# EAGLE design ServoCape_Rev2 (EAGLE 7.2.0)

## Sheet 1 of 4
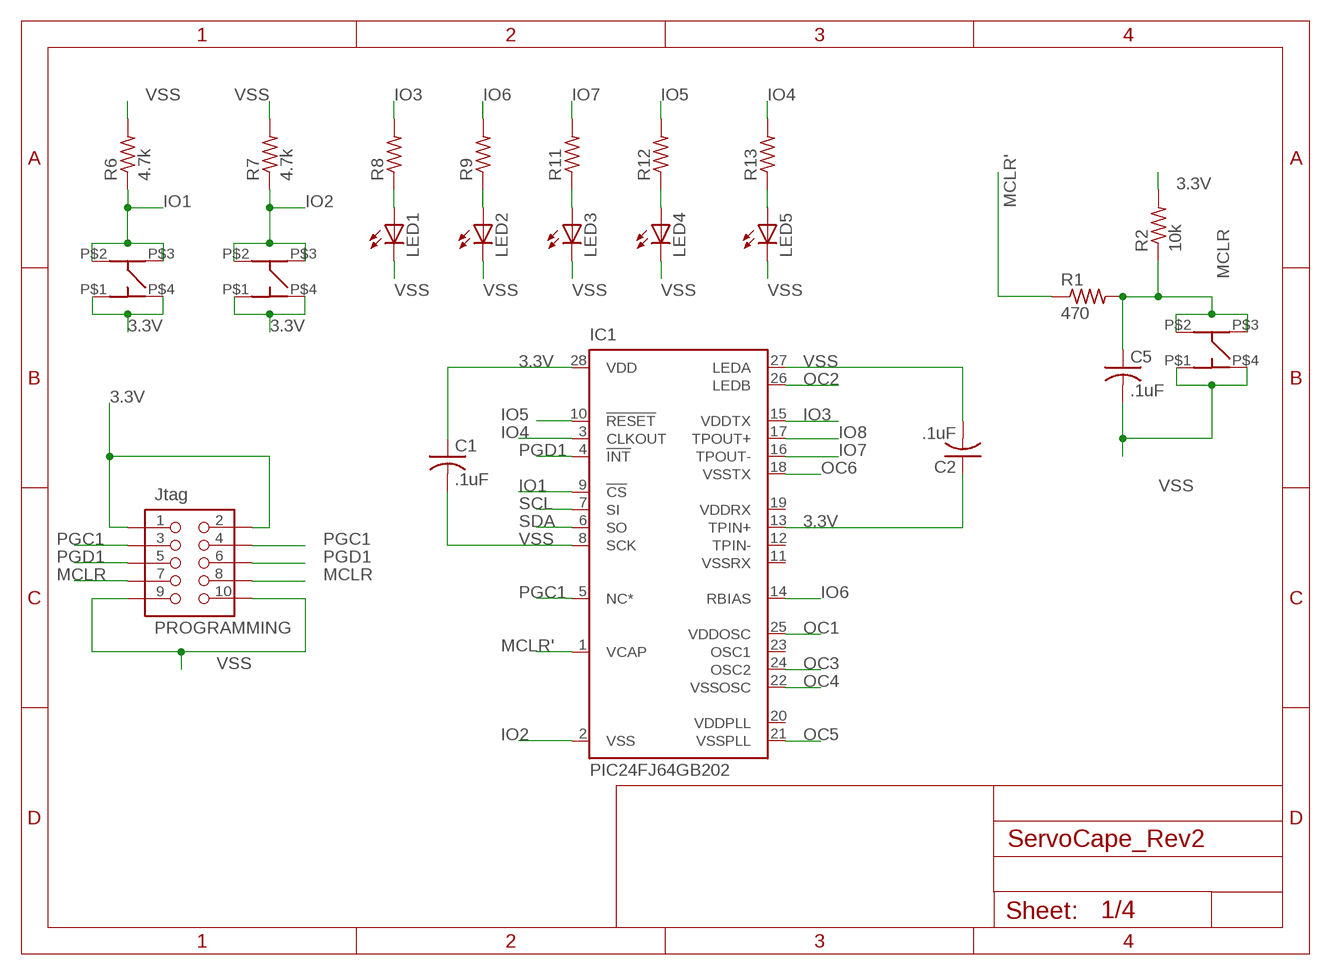
[diagram p0: schematic, sheet 1]

### Parts
C1  .1uF  C-USC0805  [C0805]
C2  .1uF  C-USC0805  [C0805]
C5  .1uF  C-USC0805  [C0805]
IC1  PIC24FJ64GB202  ENC28J60SP  [DIL28-3]
LED1  LED_LEDCHIPLED_1206  [LED_CHIPLED_1206]
LED2  LED_LEDCHIPLED_1206  [LED_CHIPLED_1206]
LED3  LED_LEDCHIPLED_1206  [LED_CHIPLED_1206]
LED4  LED_LEDCHIPLED_1206  [LED_CHIPLED_1206]
LED5  LED_LEDCHIPLED_1206  [LED_CHIPLED_1206]
PROGRAMMING  Jtag  MOTHER-BOARD-REV5_PIN-CONNECTOR74089  [MOTHER-BOARD-REV5_10-PIN-SMD]
R1  470  R-US_R0805  [R0805]
R2  10k  R-US_R0805  [R0805]
R6  4.7k  R-US_R0805  [R0805]
R7  4.7k  R-US_R0805  [R0805]
R8  R-US_M0805  [M0805]
R9  R-US_M0805  [M0805]
R11  R-US_M0805  [M0805]
R12  R-US_M0805  [M0805]
R13  R-US_M0805  [M0805]
U$1  Switch3  MC32882_SW  [MC32882_FINAL]
U$4  Switch1  MC32882_SW  [MC32882_FINAL]
U$5  Switch2  MC32882_SW  [MC32882_FINAL]

### Nets
3.3V: C1.1 C2.1 IC1.13(TPIN+) IC1.28(VDD) PROGRAMMING.1 PROGRAMMING.2 R2.2 U$4.P$1(P1) U$4.P$4(P4) U$5.P$1(P1) U$5.P$4(P4) ; also sheet 2,3
IO1: IC1.9(!CS) R6.1 U$4.P$2(P2) U$4.P$3(P3)
IO2: IC1.2(VSS) R7.1 U$5.P$2(P2) U$5.P$3(P3)
IO3: IC1.15(VDDTX) R8.2
IO4: IC1.3(CLKOUT) R13.2
IO5: IC1.10(!RESET) R12.2
IO6: IC1.14(RBIAS) R9.2
IO7: IC1.16(TPOUT-) R11.2
IO8: IC1.17(TPOUT+)
MCLR: C5.1 PROGRAMMING.7 PROGRAMMING.8 R1.2 R2.1 U$1.P$2(P2) U$1.P$3(P3)
MCLR': IC1.1(VCAP) R1.1
N$1: LED1.A R8.1
N$3: LED2.A R9.1
N$5: LED3.A R11.1
N$7: LED4.A R12.1
N$8: LED5.A R13.1
OC1: IC1.25(VDDOSC) ; also sheet 4
OC2: IC1.26(LEDB) ; also sheet 4
OC3: IC1.24(OSC2) ; also sheet 4
OC4: IC1.22(VSSOSC) ; also sheet 4
OC5: IC1.21(VSSPLL) ; also sheet 4
OC6: IC1.18(VSSTX) ; also sheet 4
PGC1: IC1.5(NC*) PROGRAMMING.3 PROGRAMMING.4
PGD1: IC1.4(!INT) PROGRAMMING.5 PROGRAMMING.6
SCL: IC1.7(SI) ; also sheet 3
SDA: IC1.6(SO) ; also sheet 3
VSS: C1.2 C2.2 C5.2 IC1.8(SCK) IC1.27(LEDA) LED1.C LED2.C LED3.C LED4.C LED5.C PROGRAMMING.9 PROGRAMMING.10 R6.2 R7.2 U$1.P$1(P1) U$1.P$4(P4) ; also sheet 2,3,4
Unconnected: IC1.11(VSSRX) IC1.12(TPIN-) IC1.19(VDDRX) IC1.20(VDDPLL) IC1.23(OSC1)

## Sheet 2 of 4: Power System
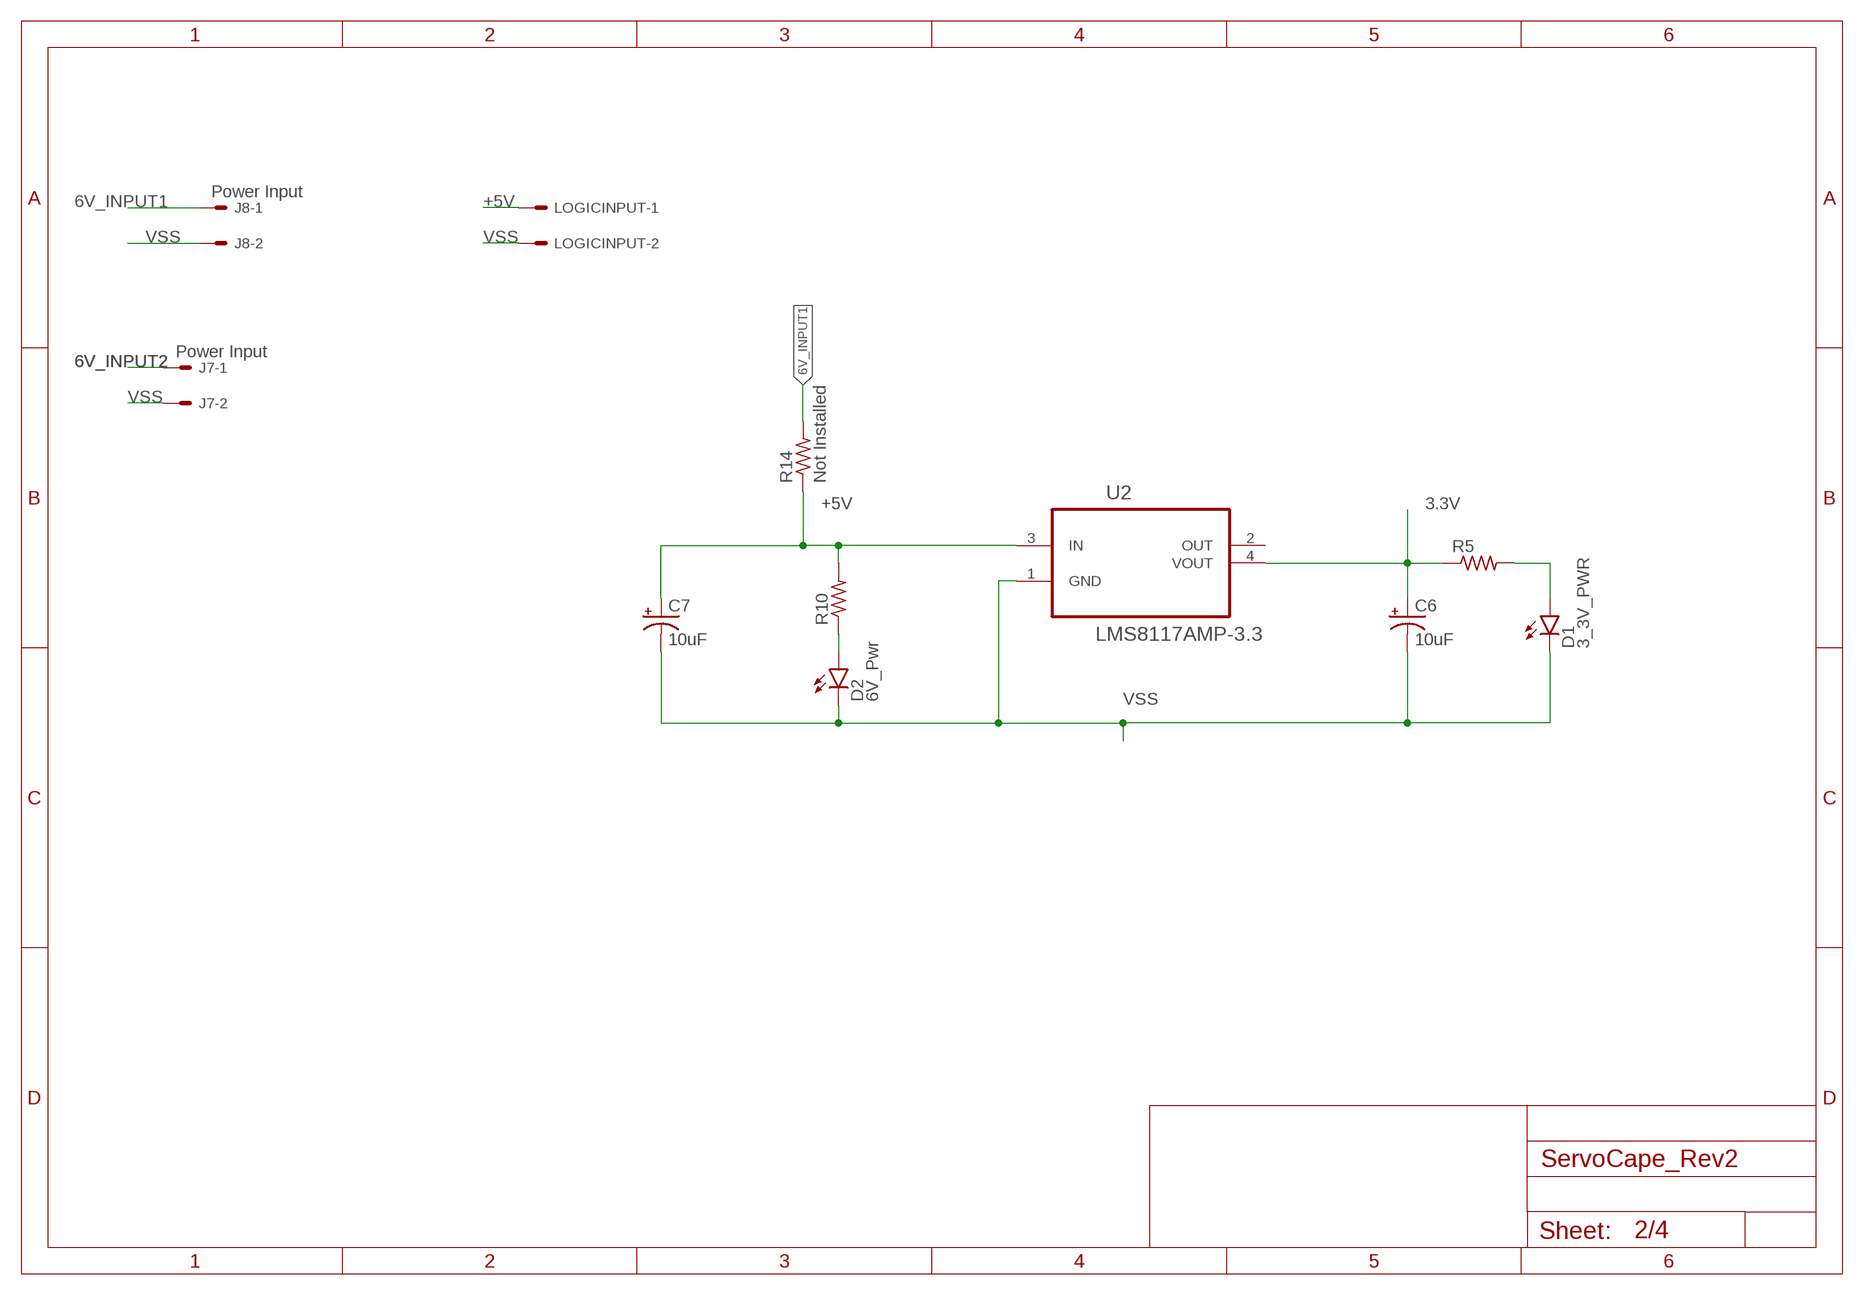
[diagram p1: schematic, sheet 2]

### Parts
C6  10uF  10UF-16V-10%(TANT)  [EIA3216]
C7  10uF  10UF-16V-10%(TANT)  [EIA3216]
D1  3_3V_PWR  LED-FKIT-1206  [FKIT-LED-1206]
D2  6V_Pwr  LED-FKIT-1206  [FKIT-LED-1206]
J7  Power Input  22-05-7028-02  [7395-02]
J8  Power Input  22-05-7028-02  [7395-02]
LOGICINPUT  22-05-7028-02  [7395-02]
R5  R-US_R0805W  [R0805W]
R10  R-US_R0805W  [R0805W]
R14  Not Installed  R-US_R0402  [R0402]
U2  LMS8117AMP-3.3  [SOT230P696X180-4N]

### Nets
3.3V: C6.A(+) R5.1 U2.4(VOUT) ; also sheet 1,3
6V_INPUT1: J8.1 R14.2 ; also sheet 4
6V_INPUT2: J7.1 ; also sheet 4
+5V: C7.A(+) LOGICINPUT.1 R10.2 R14.1 U2.3(IN)
N$6: D1.A R5.2
N$13: D2.A R10.1
VSS: C6.C(-) C7.C(-) D1.C D2.C J7.2 J8.2 LOGICINPUT.2 U2.1(GND) ; also sheet 1,3,4
Unconnected: U2.2(OUT)

## Sheet 3 of 4
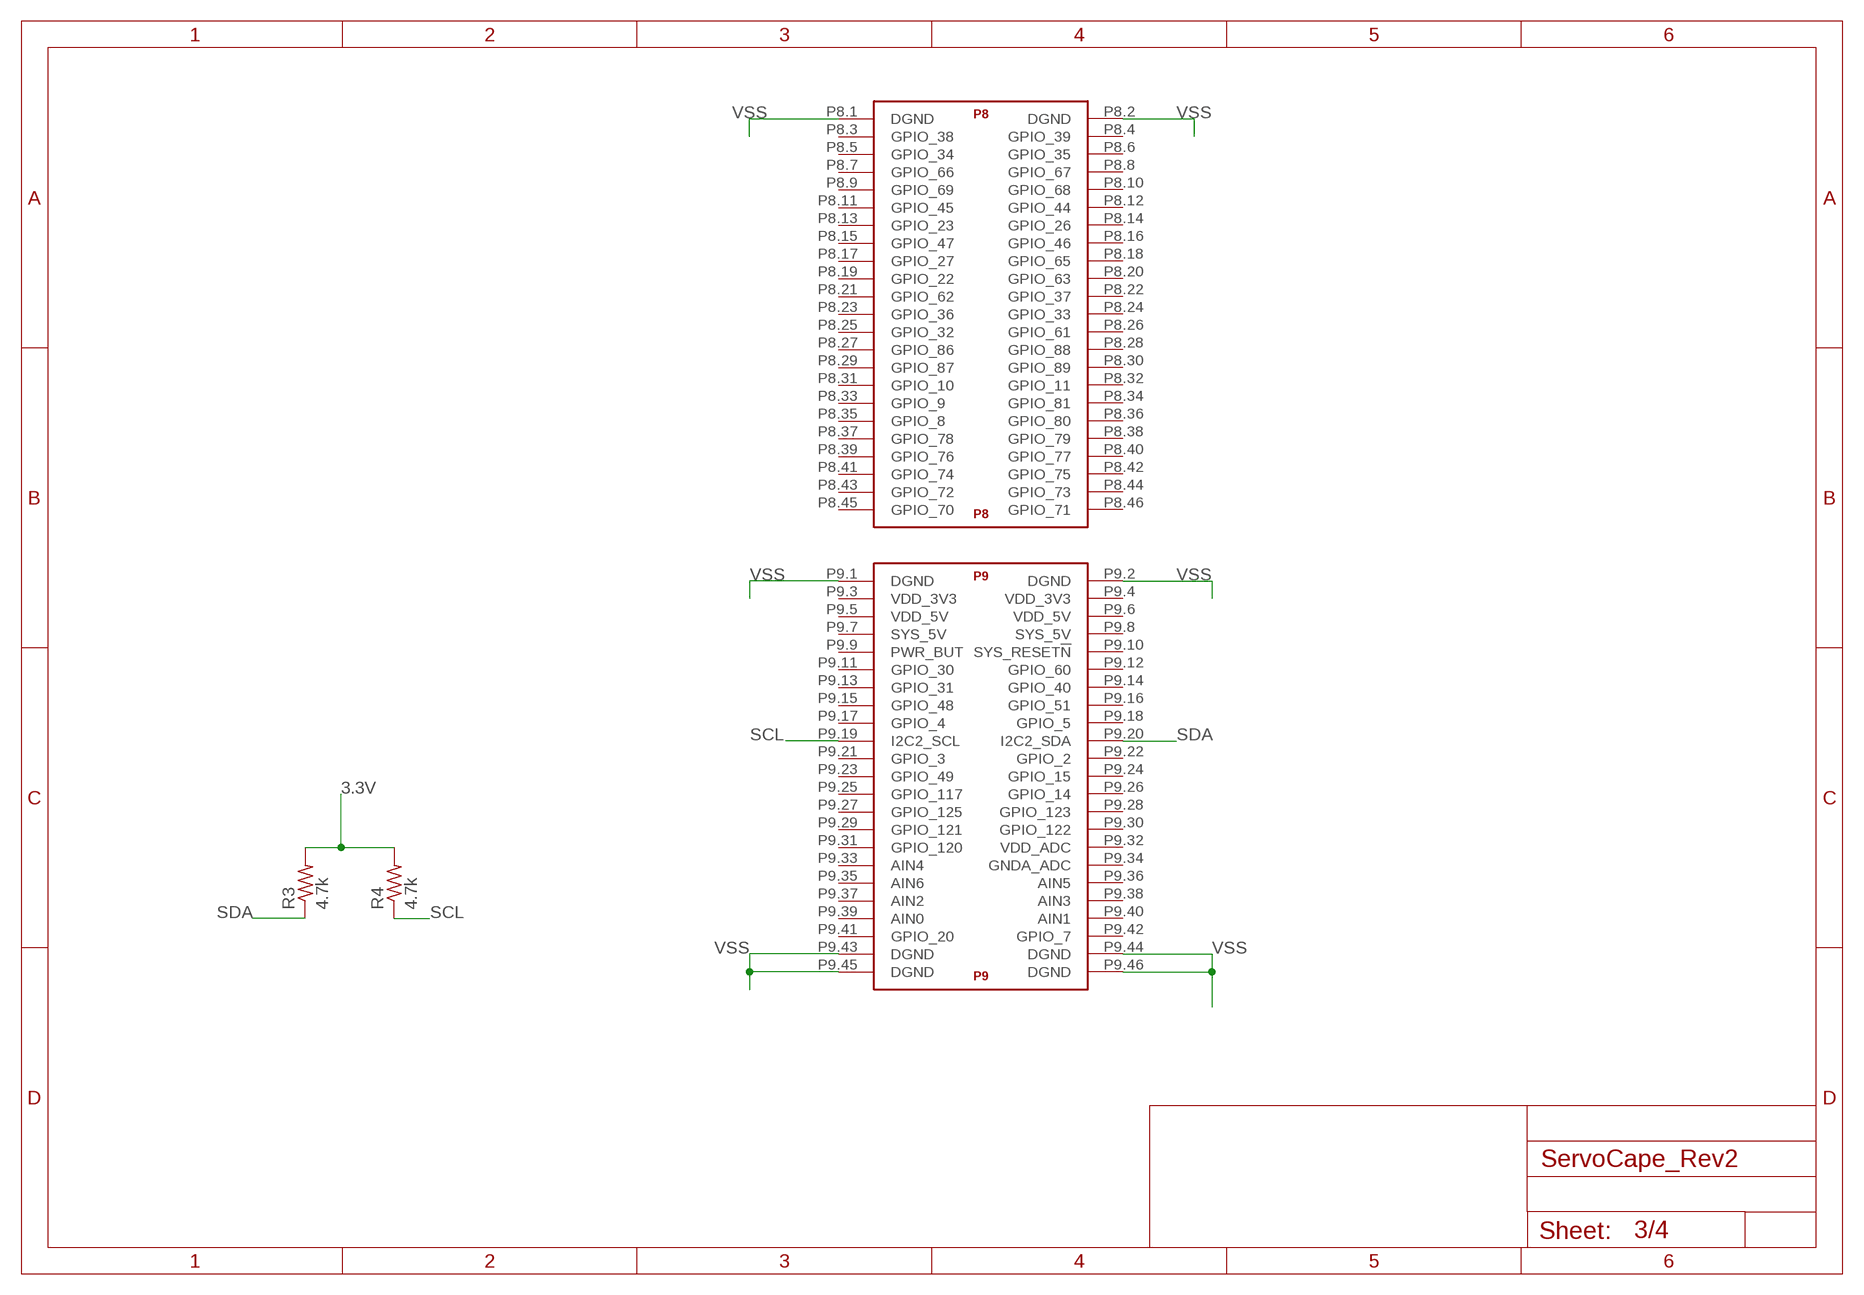
[diagram p2: schematic, sheet 3]

### Parts
R3  4.7k  R-US_R0805  [R0805]
R4  4.7k  R-US_R0805  [R0805]
U$2  BEAGLE_BONE_BLACK_CAPE  [BEAGLE_BONE_BLACK_CAPE]

### Nets
3.3V: R3.2 R4.2 ; also sheet 1,2
SCL: R4.1 U$2.P9.19(P9:I2C2_SCL) ; also sheet 1
SDA: R3.1 U$2.P9.20(P9:I2C2_SDA) ; also sheet 1
VSS: U$2.P8.1(P8:DGND) U$2.P8.2(P8:DGND) U$2.P9.1(P9:DGND) U$2.P9.2(P9:DGND) U$2.P9.43(P9:DGND) U$2.P9.44(P9:DGND) U$2.P9.45(P9:DGND) U$2.P9.46(P9:DGND) ; also sheet 1,2,4
Unconnected: U$2.P8.3(P8:GPIO_38) U$2.P8.4(P8:GPIO_39) U$2.P8.5(P8:GPIO_34) U$2.P8.6(P8:GPIO_35) U$2.P8.7(P8:GPIO_66) U$2.P8.8(P8:GPIO_67) U$2.P8.9(P8:GPIO_69) U$2.P8.10(P8:GPIO_68) U$2.P8.11(P8:GPIO_45) U$2.P8.12(P8:GPIO_44) U$2.P8.13(P8:GPIO_23) U$2.P8.14(P8:GPIO_26) U$2.P8.15(P8:GPIO_47) U$2.P8.16(P8:GPIO_46) U$2.P8.17(P8:GPIO_27) U$2.P8.18(P8:GPIO_65) U$2.P8.19(P8:GPIO_22) U$2.P8.20(P8:GPIO_63) U$2.P8.21(P8:GPIO_62) U$2.P8.22(P8:GPIO_37) U$2.P8.23(P8:GPIO_36) U$2.P8.24(P8:GPIO_33) U$2.P8.25(P8:GPIO_32) U$2.P8.26(P8:GPIO_61) U$2.P8.27(P8:GPIO_86) U$2.P8.28(P8:GPIO_88) U$2.P8.29(P8:GPIO_87) U$2.P8.30(P8:GPIO_89) U$2.P8.31(P8:GPIO_10) U$2.P8.32(P8:GPIO_11) U$2.P8.33(P8:GPIO_9) U$2.P8.34(P8:GPIO_81) U$2.P8.35(P8:GPIO_8) U$2.P8.36(P8:GPIO_80) U$2.P8.37(P8:GPIO_78) U$2.P8.38(P8:GPIO_79) U$2.P8.39(P8:GPIO_76) U$2.P8.40(P8:GPIO_77) U$2.P8.41(P8:GPIO_74) U$2.P8.42(P8:GPIO_75) U$2.P8.43(P8:GPIO_72) U$2.P8.44(P8:GPIO_73) U$2.P8.45(P8:GPIO_70) U$2.P8.46(P8:GPIO_71) U$2.P9.3(P9:VDD_3V3) U$2.P9.4(P9:VDD_3V3) U$2.P9.5(P9:VDD_5V) U$2.P9.6(P9:VDD_5V) U$2.P9.7(P9:SYS_5V) U$2.P9.8(P9:SYS_5V) U$2.P9.9(P9:PWR_BUT) U$2.P9.10(P9:SYS_RESET!N) U$2.P9.11(P9:GPIO_30) U$2.P9.12(P9:GPIO_60) U$2.P9.13(P9:GPIO_31) U$2.P9.14(P9:GPIO_40) U$2.P9.15(P9:GPIO_48) U$2.P9.16(P9:GPIO_51) U$2.P9.17(P9:GPIO_4) U$2.P9.18(P9:GPIO_5) U$2.P9.21(P9:GPIO_3) U$2.P9.22(P9:GPIO_2) U$2.P9.23(P9:GPIO_49) U$2.P9.24(P9:GPIO_15) U$2.P9.25(P9:GPIO_117) U$2.P9.26(P9:GPIO_14) U$2.P9.27(P9:GPIO_125) U$2.P9.28(P9:GPIO_123) U$2.P9.29(P9:GPIO_121) U$2.P9.30(P9:GPIO_122) U$2.P9.31(P9:GPIO_120) U$2.P9.32(P9:VDD_ADC) U$2.P9.33(P9:AIN4) U$2.P9.34(P9:GNDA_ADC) U$2.P9.35(P9:AIN6) U$2.P9.36(P9:AIN5) U$2.P9.37(P9:AIN2) U$2.P9.38(P9:AIN3) U$2.P9.39(P9:AIN0) U$2.P9.40(P9:AIN1) U$2.P9.41(P9:GPIO_20) U$2.P9.42(P9:GPIO_7)

## Sheet 4 of 4
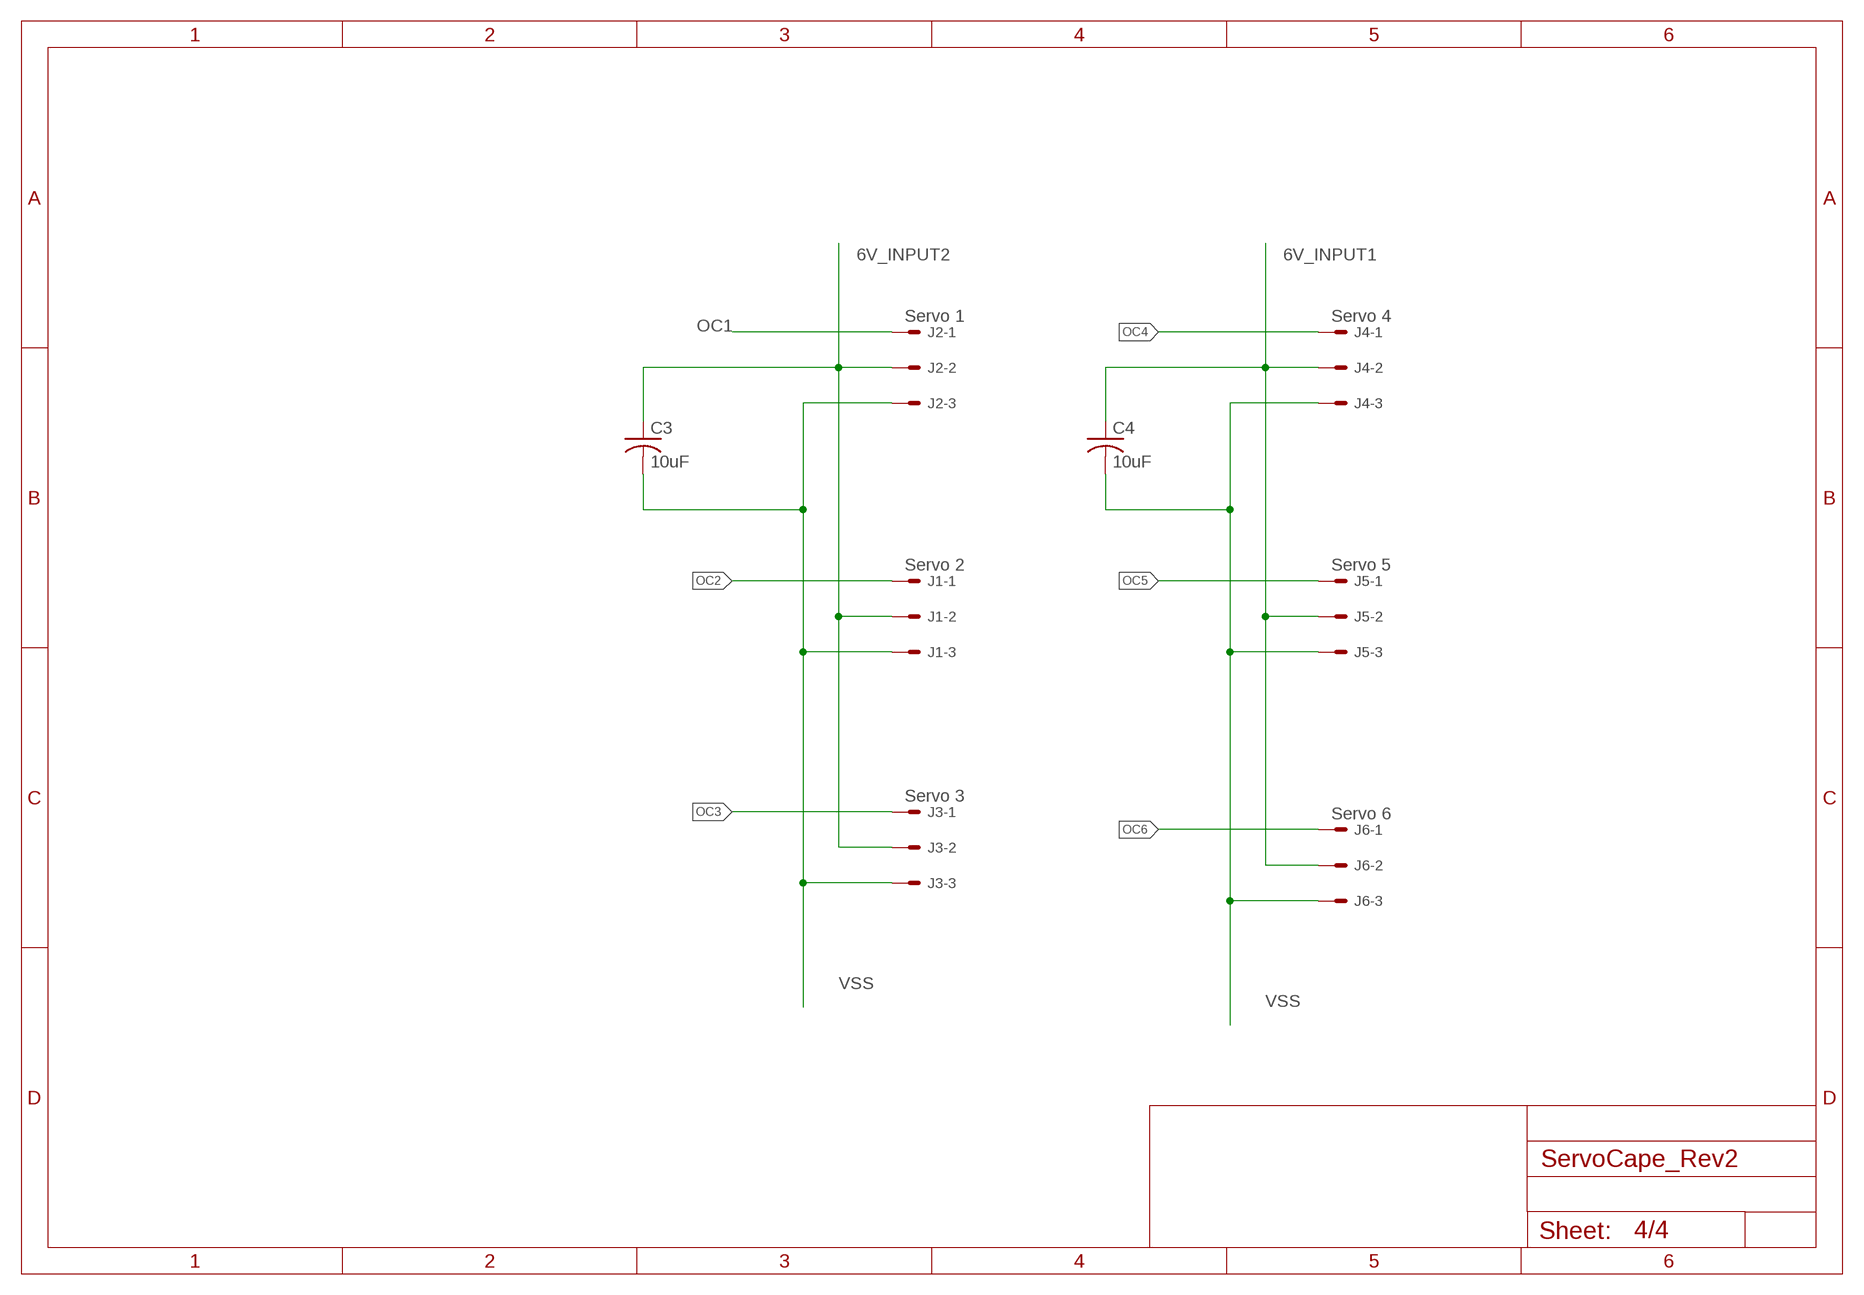
[diagram p3: schematic, sheet 4]

### Parts
C3  10uF  C-USC0805  [C0805]
C4  10uF  C-USC0805  [C0805]
J1  Servo 2  22-05-7038-03  [7395-03]
J2  Servo 1  22-05-7038-03  [7395-03]
J3  Servo 3  22-05-7038-03  [7395-03]
J4  Servo 4  22-05-7038-03  [7395-03]
J5  Servo 5  22-05-7038-03  [7395-03]
J6  Servo 6  22-05-7038-03  [7395-03]

### Nets
6V_INPUT1: C4.1 J4.2 J5.2 J6.2 ; also sheet 2
6V_INPUT2: C3.1 J1.2 J2.2 J3.2 ; also sheet 2
OC1: J2.1 ; also sheet 1
OC2: J1.1 ; also sheet 1
OC3: J3.1 ; also sheet 1
OC4: J4.1 ; also sheet 1
OC5: J5.1 ; also sheet 1
OC6: J6.1 ; also sheet 1
VSS: C3.2 C4.2 J1.3 J2.3 J3.3 J4.3 J5.3 J6.3 ; also sheet 1,2,3

## Library data of the parts
C1-C5 = rcl:C-US: CAPACITOR, American symbol
C6 C7 = SparkFun-Capacitors:10UF-16V-10%(TANT): CAP-00811 1206/EIA-3216 Tantalum capacitor; PROD_ID: CAP-00811
D1 D2 = SparkFun-LED:LED: LEDs Standard schematic elements and footprints for 5mm, 3mm, 1206, and 0603 sized LEDs. 5mm - Spark Fun Electronics SKU : COM-00529 (and others)
IC1 = microchip:ENC28J60: Stand-Alone Ethernet Controller with SPI Interface Source: http://ww1.microchip.com/downloads/en/DeviceDoc/39662c.pdf; MF: MICROCHIP; MPN: ENC28J60/SP; OC_FARNELL: 1084619; OC_NEWARK: 96K3661
J1-J6 = con-molex:22-?-03: CONNECTOR wire to board 2.54 mm (.1 inch) pitch header; OC_FARNELL: unknown; OC_NEWARK: unknown
J7 J8 LOGICINPUT = con-molex:22-?-02: CONNECTOR wire to board 2.54 mm (.1 inch) pitch header; OC_FARNELL: 9731601; OC_NEWARK: unknown
LED1-LED5 = motherboard_i_autoroute:LED_LED: LED OSRAM: - CHIPLED LG R971, LG N971, LY N971, LG Q971, LY Q971, LO R971, LY R971 LH N974, LH R974 LS Q976, LO Q976, LY Q976 LO Q996 - Hyper CHIPLED LW Q18S LB Q993, LB Q99A, LB R99A - SideLED LS A670, LO A670, LY A670, LG A670, LP A670 LB A673, LV A673, LT A673, LW A673 LH A674 LY A675 LS A676, LA A676, LO A676, LY A676, LW A676 LS A679, LY A679, LG A679 - Hyper Micro SIDELED® LS Y876, LA Y876, LO Y876, LY Y876 LT Y87S - SmartLED LW L88C, LW L88S LB L89C, LB L89S, LG L890 LS L89K, LO L89K, LY L89K LS L896, LA L896, LO L896, LY L896 - TOPLED LS T670, LO T670, LY T670, LG T670, LP T670 LSG T670, LSP T670, LSY T670, LOP T670, LYG T670 LG T671, LOG T671, LSG T671 LB T673, LV T673, LT T673, LW T673 LH T674 LS T676, LA T676, LO T676, LY T676, LB T676, LH T676, LSB T676, LW T676 LB T67C, LV T67C, LT T67C, LS T67K, LO T67K, LY T67K, LW E67C LS E67B, LA E67B, LO E67B, LY E67B, LB E67C, LV E67C, LT E67C LW T67C LS T679, LY T679, LG T679 LS T770, LO T770, LY T770, LG T770, LP T770 LB T773, LV T773, LT T773, LW T773 LH T774 LS E675, LA E675, LY E675, LS T675 LS T776, LA T776, LO T776, LY T776, LB T776 LHGB T686 LT T68C, LB T68C - Hyper Mini TOPLED® LB M676 - Mini TOPLED Santana® LG M470 LS M47K, LO M47K, LY M47K Source: http://www.osram.convergy.de LUXEON: - LUMILED® LXK2-PW12-R00, LXK2-PW12-S00, LXK2-PW14-U00, LXK2-PW14-V00 LXK2-PM12-R00, LXK2-PM12-S00, LXK2-PM14-U00 LXK2-PE12-Q00, LXK2-PE12-R00, LXK2-PE12-S00, LXK2-PE14-T00, LXK2-PE14-U00 LXK2-PB12-K00, LXK2-PB12-L00, LXK2-PB12-M00, LXK2-PB14-N00, LXK2-PB14-P00, LXK2-PB14-Q00 LXK2-PR12-L00, LXK2-PR12-M00, LXK2-PR14-Q00, LXK2-PR14-R00 LXK2-PD12-Q00, LXK2-PD12-R00, LXK2-PD12-S00 LXK2-PH12-R00, LXK2-PH12-S00 LXK2-PL12-P00, LXK2-PL12-Q00, LXK2-PL12-R00 Source: www.luxeon.com KINGBRIGHT: KA-3528ASYC Source: www.kingbright.com
PROGRAMMING = Mother-Board-rev5:MOTHER-BOARD-REV5_PIN-CONNECTOR
R1-R14 = rcl:R-US_: RESISTOR, American symbol
U2 = NSC-LMS8117AMP:LMS8117AMP-3.3: Low-Dropout Linear Regulator; MPN: LMS8117AMP-3.3; OC_FARNELL: 1469032; OC_NEWARK: 41K3020; PACKAGE: SOT-223-3; SUPPLIER: National Semiconductor
U$1 U$4 U$5 = Parts4Class:MC32882_SW
U$2 = SparkFun-Boards:BEAGLE_BONE_BLACK_CAPE

## Net classes
0 default: width 0.203 mm, drill 0.508 mm, clearance 0.254 mm

## Board
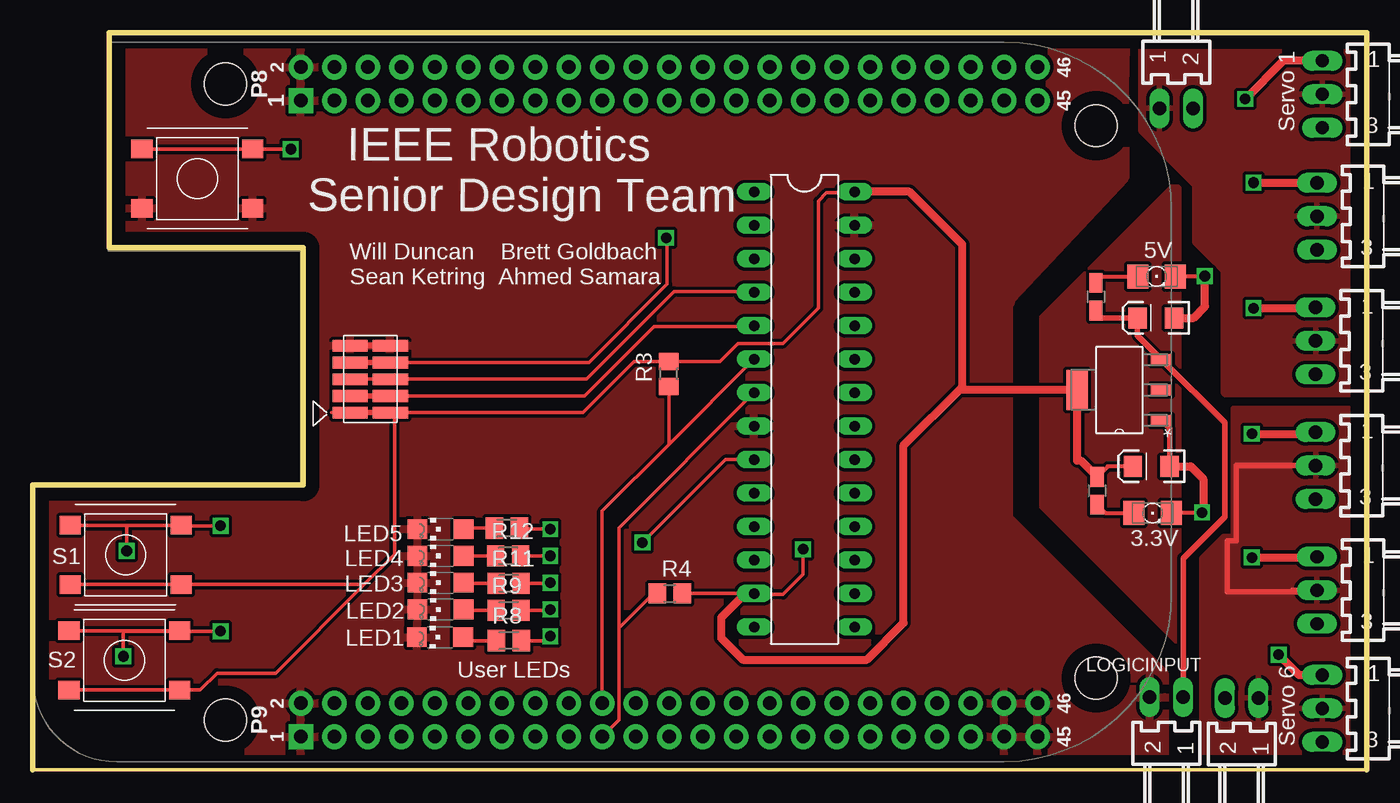
[diagram p4: board, top side]
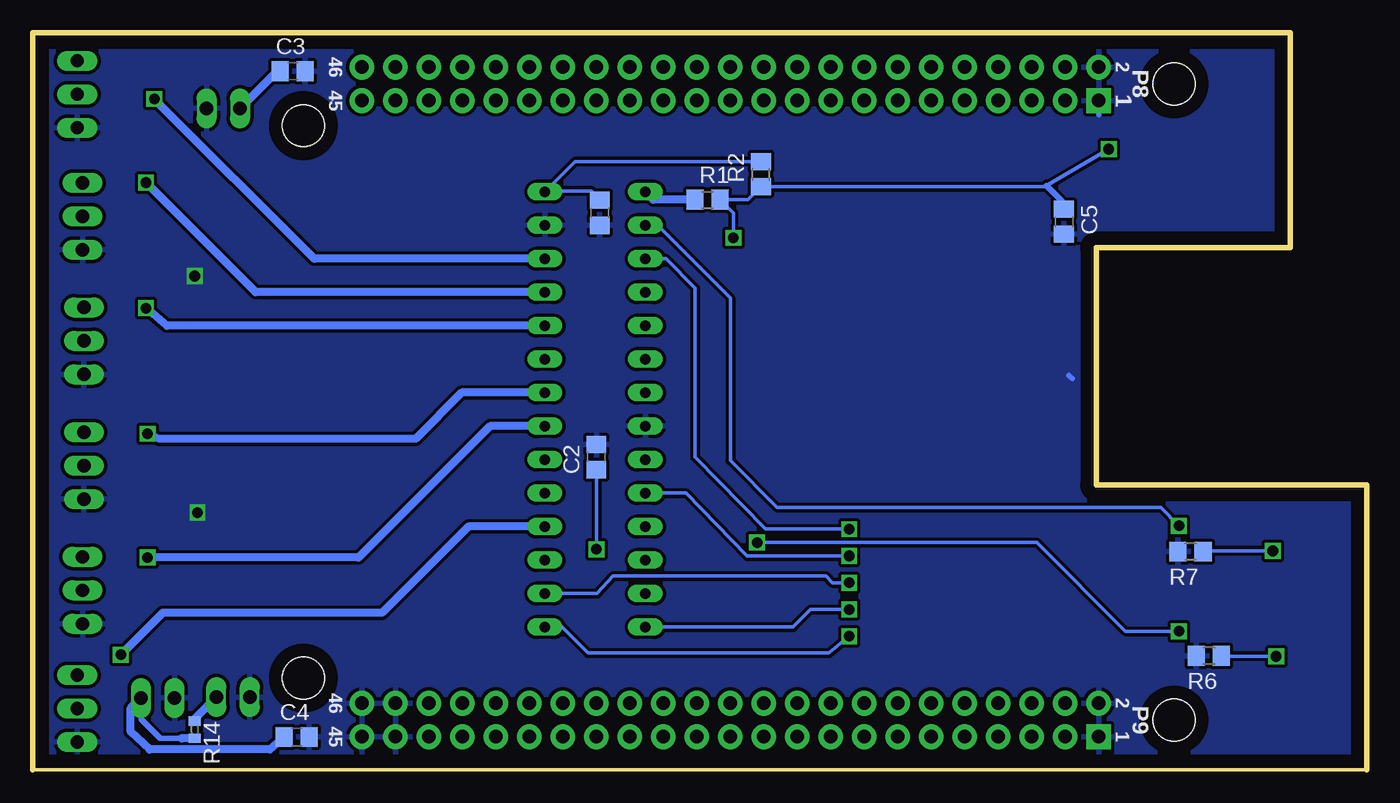
[diagram p5: board, bottom side, seen from below]

Size 101.15 x 55.9 mm. Coordinates in mm from the lower left corner, seen from the top.
Outline: 5.8,55.9 5.8,39.6 20.5,39.6 20.5,21.6 0,21.6 0,0 101.15,0 101.15,55.9 5.8,55.9
Copper layers (1*16): Top 0.035mm / dielectric 1.5mm / Bottom 0.035mm
Design rules "default *": minimum track width 10mil, minimum drill 24mil, track to track 8mil, track to pad 8mil, pad to pad 8mil, via to via 8mil, smd to smd 8mil, copper to edge 40mil, drill to drill 8mil, minimum pad ring 10mil, minimum via ring 8mil, stop-mask expansion 4mil, vias tented up to drill 0mil, thermal gap 10mil

### Footprints (pad centres in the part's own frame; a part is rotated, then mirrored left to right if it is on the bottom)
C0805 = smd 1.3 x 1.5: 1 -0.95,0; 2 0.95,0
EIA3216 = smd 1.4 x 1.6: A 1.4,0; C -1.4,0
FKIT-LED-1206 = smd 1.6 x 1.803: A -1.422,0; C 1.422,0
DIL28-3 = drill 0.813 long: 1 -16.51,-3.81; 2 -13.97,-3.81; 3 -11.43,-3.81; 4 -8.89,-3.81; 5 -6.35,-3.81; 6 -3.81,-3.81; 7 -1.27,-3.81; 8 1.27,-3.81; 9 3.81,-3.81; 10 6.35,-3.81; 11 8.89,-3.81; 12 11.43,-3.81; 13 13.97,-3.81; 14 16.51,-3.81; 15 16.51,3.81; 16 13.97,3.81; 17 11.43,3.81; 18 8.89,3.81; 19 6.35,3.81; 20 3.81,3.81; 21 1.27,3.81; 22 -1.27,3.81; 23 -3.81,3.81; 24 -6.35,3.81; 25 -8.89,3.81; 26 -11.43,3.81; 27 -13.97,3.81; 28 -16.51,3.81
7395-03 = drill 1.016 long: 1 2.54,0; 2 0,0; 3 -2.54,0
7395-02 = drill 1.016 long: 1 1.27,0; 2 -1.27,0
LED_CHIPLED_1206 = smd 1.5 x 1.5: A 0,-1.75; C 0,1.75
MOTHER-BOARD-REV5_10-PIN-SMD = smd 0.889 x 2.667: 1 -2.54,1.524; 2 -2.54,-1.524; 3 -1.27,1.524; 4 -1.27,-1.524; 5 0,1.524; 6 0,-1.524; 7 1.27,1.524; 8 1.27,-1.524; 9 2.54,1.524; 10 2.54,-1.524
R0805 = smd 1.3 x 1.5: 1 -0.95,0; 2 0.95,0
R0805W = smd 1.5 x 1: 1 -1.052,0; 2 1.052,0
M0805 = smd 1.3 x 1.6: 1 -0.95,0; 2 0.95,0
R0402 = smd 0.7 x 0.9: 1 -0.65,0; 2 0.65,0
SOT230P696X180-4N = smd 1.6 x 0.838: 1 -3.2,2.311; 2 -3.2,0; 3 -3.2,-2.311 | smd 1.6 x 3.023: 4 3.2,0
MC32882_FINAL = smd 1.6 x 1.4: P$1 -4.2,-2.25; P$2 -4.2,2.25; P$3 4.2,2.25; P$4 4.2,-2.25
BEAGLE_BONE_BLACK_CAPE = drill 1.016 pad 1.88 square: P8.1 20.32,50.165; P9.1 20.32,1.905 | drill 1.016 pad 1.88: P8.2 20.32,52.705; P8.3 22.86,50.165; P8.4 22.86,52.705; P8.5 25.4,50.165; P8.6 25.4,52.705; P8.7 27.94,50.165; P8.8 27.94,52.705; P8.9 30.48,50.165; P8.10 30.48,52.705; P8.11 33.02,50.165; P8.12 33.02,52.705; P8.13 35.56,50.165; P8.14 35.56,52.705; P8.15 38.1,50.165; P8.16 38.1,52.705; P8.17 40.64,50.165; P8.18 40.64,52.705; P8.19 43.18,50.165; P8.20 43.18,52.705; P8.21 45.72,50.165; P8.22 45.72,52.705; P8.23 48.26,50.165; P8.24 48.26,52.705; P8.25 50.8,50.165; P8.26 50.8,52.705; P8.27 53.34,50.165; P8.28 53.34,52.705; P8.29 55.88,50.165; P8.30 55.88,52.705; P8.31 58.42,50.165; P8.32 58.42,52.705; P8.33 60.96,50.165; P8.34 60.96,52.705; P8.35 63.5,50.165; P8.36 63.5,52.705; P8.37 66.04,50.165; P8.38 66.04,52.705; P8.39 68.58,50.165; P8.40 68.58,52.705; P8.41 71.12,50.165; P8.42 71.12,52.705; P8.43 73.66,50.165; P8.44 73.66,52.705; P8.45 76.2,50.165; P8.46 76.2,52.705; P9.2 20.32,4.445; P9.3 22.86,1.905; P9.4 22.86,4.445; P9.5 25.4,1.905; P9.6 25.4,4.445; P9.7 27.94,1.905; P9.8 27.94,4.445; P9.9 30.48,1.905; P9.10 30.48,4.445; P9.11 33.02,1.905; P9.12 33.02,4.445; P9.13 35.56,1.905; P9.14 35.56,4.445; P9.15 38.1,1.905; P9.16 38.1,4.445; P9.17 40.64,1.905; P9.18 40.64,4.445; P9.19 43.18,1.905; P9.20 43.18,4.445; P9.21 45.72,1.905; P9.22 45.72,4.445; P9.23 48.26,1.905; P9.24 48.26,4.445; P9.25 50.8,1.905; P9.26 50.8,4.445; P9.27 53.34,1.905; P9.28 53.34,4.445; P9.29 55.88,1.905; P9.30 55.88,4.445; P9.31 58.42,1.905; P9.32 58.42,4.445; P9.33 60.96,1.905; P9.34 60.96,4.445; P9.35 63.5,1.905; P9.36 63.5,4.445; P9.37 66.04,1.905; P9.38 66.04,4.445; P9.39 68.58,1.905; P9.40 68.58,4.445; P9.41 71.12,1.905; P9.42 71.12,4.445; P9.43 73.66,1.905; P9.44 73.66,4.445; P9.45 76.2,1.905; P9.46 76.2,4.445 | hole 3.175: 14.605,3.175; 80.645,6.35; 80.645,48.26; 14.605,51.435

### Placement (x,y rotation side)
C1  58.17,42.26 270 bottom
C2  58.42,23.71 90 bottom
C3  81.46,53 0 bottom
C4  81.15,2.48 0 bottom
C5  22.95,41.58 270 bottom
C6  84.83,23.02 180 top
C7  85.17,34.28 180 top
D1  84.93,19.47 0 top
D2  85.24,37.42 0 top
IC1  58.51,27.34 270 top
J1  97.79,51.25 90 top
J2  97.39,41.99 90 top
J3  97.29,32.53 90 top
J4  97.29,23.07 90 top
J5  97.39,13.61 90 top
J6  97.79,4.65 90 top
J7  86.72,50.18 180 top
J8  91.69,5.45 0 top
LED1  30.87,10.06 90 top
LED2  30.91,12.16 90 top
LED3  30.91,14.19 90 top
LED4  30.91,16.22 90 top
LED5  30.91,18.25 90 top
LOGICINPUT  85.98,5.5 0 top
PROGRAMMING  25.58,29.63 90 top
R1  49.98,43.24 0 bottom
R2  45.94,45.18 90 bottom
R3  48.23,30.03 90 top
R4  48.3,13.37 0 top
R5  80.72,21.16 270 top
R6  11.95,8.65 180 bottom
R7  13.35,16.55 180 bottom
R8  36.09,9.79 0 top
R9  36.07,12.08 0 top
R10  80.61,35.88 270 top
R11  36.07,14.14 0 top
R12  36.04,16.22 0 top
R13  35.94,18.33 0 top
R14  88.87,3.04 270 bottom
U2  82.4,28.81 180 top
U$1  12.47,44.85 0 top
U$2  0,0.6 0 top
U$4  6.93,8.3 0 top
U$5  7.03,16.3 0 top

### Tracks (layer width: path | path; a pad name or v marks a point on that pad's centre or on a via)
3.3V  (via drill 0.8)
  Top 0.254: R4.2 IC1.13 54.77,13.3 56.9,13.3 58.42,14.82 v58.42,16.73 | IC1.28 62.26,43.78 60.2,43.78 59.56,43.15 59.56,35.02 56.9,32.35 53.47,32.35 52.1,30.98 R3.2 48.21,30.95 45.59,30.95 41.73,27.09 PROGRAMMING.2 27.43,26.77 27.43,16.35 25.14,14.05 | U$4.P$1 U$4.P$4 12.69,6.05 13.97,7.33 18.41,7.33 25.14,14.05 | 25.14,14.05 U$5.P$4 U$5.P$1 | PROGRAMMING.1 22.66,27.09
  Top 0.305: C6.A 81.52,23.02 R5.1
  Top 0.406: PROGRAMMING.1 PROGRAMMING.2
  Top 0.61: R5.1 79.48,23.46 79.2,23.46 U2.4 70.57,28.81 70.41,28.97 | 70.41,28.97 70.48,29.05 70.48,39.84 66.48,43.85 IC1.28 | IC1.13 54.04,13.37 52.2,11.52 52.2,10 53.85,8.35 63.25,8.35 66.04,11.14 66.04,24.6 70.41,28.97
  Bottom 0.254: C2.1 v58.42,16.73 | C1.1 58.17,43.27 58.8,43.91 62.27,43.91 IC1.28 60.05,46.13 R2.2
6V_INPUT1
  Top 0.406: 95.53,13.48 95.53,13.61 J5.2 97.39,13.48 90.58,13.48 90.58,17.36 91.26,17.36 91.26,23.07 J4.2 95,23.07 95,23.08
  Bottom 0.406: J8.1 92.96,3.82 91.52,2.38 89.86,2.38
  Bottom 0.61: C4.1 83.19,1.54 92.3,1.54 93.73,2.86 93.73,4.68 J8.1 | R14.2 89.84,2.39 89.86,2.38
  pour Top: 88.75,1.13 99.82,1.13 99.82,17.69 90.32,17.69 88.65,16.02 88.65,1.23
  pour Top: 91.06,17.72 99.82,17.72 99.82,27.42 91.06,27.42
6V_INPUT2
  Bottom 0.61: C3.1 82.63,53 J7.1
  pour Top: 90.3,28.64 90.3,37.89 88.14,40.05 88.14,44.36 84.02,48.48 84.02,54.73 84,54.75 100.71,54.75 100.71,28.46 90.45,28.46 90.3,28.62
+5V
  Top 0.406: R10.2 80.61,34.28 C7.A 83.77,32.96 U2.3 90.4,26.33 90.4,19.19 87.25,16.04 LOGICINPUT.1
  Bottom 0.61: R14.1 88.88,3.88 LOGICINPUT.1
IO1  (via drill 0.8)
  Top 0.254: U$4.P$2 U$4.P$3 11.18,10.51 | IC1.9 52.52,23.53 v46.23,17.24 | v14.22,10.51 11.18,10.51 | 11.18,10.51 6.86,10.51 v6.86,8.6
  Bottom 0.254: v46.23,17.24 25.02,17.24 18.29,10.51 v14.22,10.51 | v6.86,8.6 11,8.6 R6.1
IO2  (via drill 0.8)
  Top 0.254: U$5.P$2 7.11,18.55 | 7.11,18.55 U$5.P$3 11.28,18.51 v14.22,18.51 | 7.11,18.55 v7.11,16.6
  Bottom 0.254: v7.11,16.6 12.4,16.6 R7.1 | IC1.2 53.79,41.31 48.26,35.78 48.26,23.46 44.7,19.9 15.62,19.9 v14.22,18.51
IO3  (via drill 0.8)
  Top 0.254: R8.2 38.91,9.79 v39.24,10.12
  Bottom 0.254: IC1.15 61.03,10.83 59.05,8.86 40.77,8.86 v39.24,10.12
IO4  (via drill 0.8)
  Top 0.254: v39.24,18.25 36.97,18.25 R13.2
  Bottom 0.254: IC1.3 53.16,38.77 50.93,36.54 50.93,23.71 45.59,18.25 v39.24,18.25
IO5  (via drill 0.8)
  Top 0.254: R12.2 v39.24,16.22
  Bottom 0.254: IC1.10 51.63,20.99 46.99,16.22 v39.24,16.22
IO6  (via drill 0.8)
  Top 0.254: R9.2 39.17,12.08 v39.24,12.16
  Bottom 0.254: IC1.14 43.49,10.83 42.16,12.16 v39.24,12.16
IO7  (via drill 0.8)
  Top 0.254: R11.2 39.19,14.14 v39.24,14.19
  Bottom 0.254: IC1.16 58.35,13.37 57.15,14.7 41.02,14.7 40.51,14.19 v39.24,14.19
MCLR  (via drill 0.8)
  Top 0.254: U$1.P$2 U$1.P$3 16.68,47.08 v19.56,47.08 | PROGRAMMING.8 42.16,30.9 48.11,36.85 48.11,40.27 v48.03,40.35
  Top 0.406: PROGRAMMING.7 PROGRAMMING.8
  Bottom 0.254: v19.56,47.08 24.28,44.32 24.44,44.23 R2.1 46.92,43.24 R1.2 48.03,42.24 v48.03,40.35
  Bottom 0.406: C5.1 22.95,42.99 24.28,44.32
MCLR'
  Bottom 0.61: R1.1 54.1,43.24 IC1.1
N$1
  Top 0.254: R8.1 32.88,9.79 LED1.A
N$2
  pour Top: 87,9.36 87,44.16 86.87,44.29 86.36,44.29 76.45,34.38 76.45,19.9
N$3
  Top 0.254: R9.1 32.74,12.08 LED2.A
N$5
  Top 0.254: R11.1 32.71,14.14 LED3.A
N$6
  Top 0.305: R5.2 81.36,19.47 D1.A
N$7
  Top 0.254: R12.1 LED4.A
N$8
  Top 0.254: R13.1 32.74,18.33 LED5.A
N$13
  Top 0.305: R10.1 81.1,37.42 D2.A
OC1  (via drill 0.8)
  Top 0.61: v92.58,44.54 97.38,44.54 J2.1
  Bottom 0.61: IC1.25 84.27,36.23 v92.58,44.54
OC2  (via drill 0.8)
  Top 0.61: v91.95,50.89 94.87,53.81 97.77,53.81 J1.1
  Bottom 0.61: IC1.26 79.83,38.77 v91.95,50.89
OC3  (via drill 0.8)
  Top 0.61: v92.58,35.02 97.24,35.02 J3.1
  Bottom 0.61: IC1.24 91,33.69 v92.58,35.02
OC4  (via drill 0.8)
  Top 0.61: v92.46,25.49 97.18,25.49 J4.1
  Bottom 0.61: IC1.22 68.64,28.61 72.14,25.11 91.57,25.11 v92.46,25.49
OC5  (via drill 0.8)
  Top 0.61: v92.46,16.09 97.34,16.09 J5.1
  Bottom 0.61: IC1.21 66.48,26.07 76.45,16.09 v92.46,16.09
OC6  (via drill 0.8)
  Top 0.61: 97.78,7.2 J6.1 96.03,7.19 v94.49,8.73
  Bottom 0.61: IC1.18 68.13,18.45 74.68,11.9 91.31,11.9 v94.49,8.73
PGC1
  Top 0.254: PROGRAMMING.4 41.86,28.36 47.12,33.62 54.63,33.62 IC1.5
  Top 0.406: PROGRAMMING.4 PROGRAMMING.3
PGD1
  Top 0.254: PROGRAMMING.5 PROGRAMMING.6 41.98,29.63 48.64,36.29 54.65,36.29 IC1.4
SCL
  Top 0.254: U$2.P9.19 44.45,3.77 44.45,10.76 | 44.45,10.76 44.45,18.36 IC1.7 | R4.1 47.06,13.37 44.45,10.76
SDA
  Top 0.254: U$2.P9.20 43.18,19.62 48.23,24.68 | 48.23,24.68 IC1.6 | R3.1 48.23,24.68
VSS  (via drill 0.8)
  Top 0.305: D2.C 86.69,37.45 v88.89,37.45 v88.9,37.44 | D1.C 86.39,19.52 v88.68,19.52
  Top 0.406: PROGRAMMING.9 PROGRAMMING.10 | C6.C 86.23,25.88 U2.1
  Top 0.61: C7.C 88.04,34.28 88.9,35.14 v88.9,37.44 | C6.C 87.82,23.02 88.77,22.06 88.77,19.62 v88.68,19.52
  Bottom 0.406: U$2.P8.1 20.32,49.7 | 22.57,29.92 22.32,29.67
  pour Bottom: 6.6,55.34 6.6,55.21 100.08,55.21 100.08,0.6 0.64,0.6 0.64,20.67 21.46,20.67 21.46,40.35 6.35,40.35 6.35,55.34
  pour Top: 0.64,20.67 21.72,20.67 21.72,40.48 6.73,40.48 6.73,55.21 82.88,54.93 82.8,51.78 82.85,44.9 74.17,35.65 74.17,35.4 74.04,35.27 74.04,19.14 85.85,7.33 85.85,0.98 0.64,0.98

### Text on the board
tPlace: Servo 1 | IEEE Robotics / Senior Design Team | 5V | Will Duncan Brett Goldbach / Sean Ketring Ahmed Samara | 3.3V | S1 | S2 | User LEDs | Servo 6